# Altium schematic sheet 电源.SchDoc
size A4
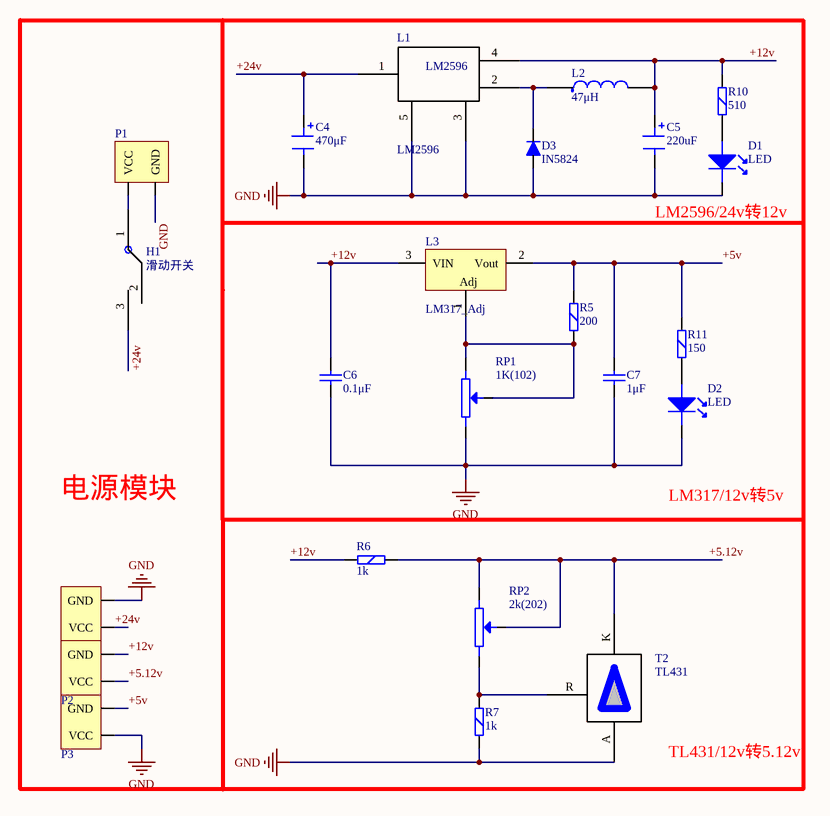
[diagram p0: 电源.SchDoc]

## Parts
C4  470μF  [电解电容_大]
C5  220uF  [电解电容_大]
C6  0.1μF  [电容_瓷片]
C7  1μF  [电容_瓷片]
D1  LED  [LED_G]
D2  LED  [LED_G]
D3  IN5824  [二极管_整流]
H1  滑动开关  [滑动开关]
L1  LM2596  [LM2596]
L2  47μH  [AL0410_V]
L3  LM317_Adj  [7805散热器]
P1  电源端子2P  [端子 - duplicate]  (value not drawn)
P2  电源端子2P  [端子 - duplicate]  (value not drawn)
P3  电源端子2P  [端子 - duplicate]  (value not drawn)
P4  电源端子2P  [端子 - duplicate]  (value not drawn)
R5  200  [1/4WA1]
R6  1k  [1/4WA1]
R7  1k  [1/4WA1]
R10  510  [1/4WA1]
R11  150  [1/4WA1]
RP1  1K(102)  [3296-103]
RP2  2k(202)  [3296-200]
T2  TL431  [TL431]

## Nets
GND: C4.2 C5.2 C6.1 C7.1 D1.2(K) D2.2(K) D3.1(A) L1.3 L1.5 P1.2(GND) P3.1(VCC) P4.2(GND) R7.2 RP1.2 T2.A
+5.12v: P2.1(VCC) R6.2 RP2.1 RP2.3 T2.K
+5v: C7.2 L3.2(Vout) P3.2(GND) R5.1 R11.1
+12v: C5.1 C6.2 L1.4 L2.2 L3.3(VIN) P2.2(GND) R6.1 R10.1
+24v: C4.1 H1.3 L1.1 P4.1(VCC)
NetD1_1: D1.1(A) R10.2
NetD2_1: D2.1(A) R11.2
NetD3_2: D3.2(K) L1.2 L2.1
NetH1_1: H1.1 P1.1(VCC)
NetL3_1: L3.1(Adj) R5.2 RP1.1 RP1.3
NetR7_1: R7.1 RP2.2 T2.R

Not connected (* = marked no-connect by the designer): H1 2

## Notes on the sheet
- (near D1) LM2596/24v转12v
- 电源模块
- LM317/12v转5v
- TL431/12v转5.12v

## Library data of the parts
C4 C5 = 电解电容_大: 电解电容
C6 C7 = 电容_瓷片: 瓷片电容
D1 D2 = LED: 发光二极管; Component Link1Description: 元件数据连接1，一般是生产厂商的元件描述连接。; Component Link 1URL: 元件厂商的网站连接1，通常是主页地址，如http://www.st.com/; ComponentLink2  Description: 元件数据连接2，一般是生产厂商的元件数据库连接。; Component Link 2URL: 元件厂商的网站连接2，通常是元件数据说明文件地址，如http://www.fairchildsemi.com/ds/2N%2F2N3904.pdf; Kind: General; Latest Revision Note: 最近的应用笔记修订本; Object: Diode; Created: 制造厂商; Datasheet Version: Apr-2016; Latest Revision Date: 13-Apr-2016; Package Description: DIODE0.4及DIODE0.7; Published: 13-Apr-2016; Publisher: Altium Limited; Spice Prefix: D; SubKind: Diode; Type: Diode
D3 = 二极管_整流: 整流二极管
L2 = Inductor4: Component Link1Description: 元件数据连接1，一般是生产厂商的元件描述连接。; Component Link 1URL: 元件厂商的网站连接1，通常是主页地址，如http://www.st.com/; ComponentLink2  Description: 元件数据连接2，一般是生产厂商的元件数据库连接。; Component Link 2URL: 元件厂商的网站连接2，通常是元件数据说明文件地址，如http://www.fairchildsemi.com/ds/2N%2F2N3904.pdf; Kind: General; Latest Revision Note: 最近的应用笔记修订本; Published: 13-Apr-2016; LatestRevisionDate: 13-Apr-2016; LatestRevisionNote: Re-released for DXP Platform.; PackageReference: 425; Publisher: Altium Limited; Created: 制造厂商; Datasheet Version: Apr-2016; Latest Revision Date: 13-Apr-2016; Object: Inductor; Package Description: 封装描述; Spice Prefix: L; SubKind: Inductor
L3 = LM317: 可调直流稳压芯片
P1-P4 = 电源端子2P: 电源端子
R5-R7 R10 R11 = Res_3: 1/4W电阻器; Object: Resistor; Kind: General; Latest Revision Note: 最近的应用笔记修订本; Component Link1Description: 元件数据连接1，一般是生产厂商的元件描述连接。; ComponentLink2  Description: 元件数据连接2，一般是生产厂商的元件数据库连接。; Component Link 1URL: 元件厂商的网站连接1，通常是主页地址，如http://www.st.com/; Component Link 2URL: 元件厂商的网站连接2，通常是元件数据说明文件地址，如http://www.fairchildsemi.com/ds/2N%2F2N3904.pdf; Value: 10K; LatestRevisionDate: 13-Apr-2016; Published: 13-Apr-2016; Publisher: Altium Limited; Created: 制造厂商; Datasheet Version: Apr-2016; Package Reference: AXIAL; Spice Prefix: R; Latest Revision Date: 13-Apr-2016; Package Description: AXIAL0.3-AXIA1.0; PackageVersion: Apr-2016; SubKind: Resistor; Type: Resistor
RP1 RP2 = RESVR: 滑动触点电位器; Object: Resistor; Kind: General; Latest Revision Note: 最近的应用笔记修订本; Component Link1Description: 元件数据连接1，一般是生产厂商的元件描述连接。; ComponentLink2  Description: 元件数据连接2，一般是生产厂商的元件数据库连接。; Component Link 1URL: 元件厂商的网站连接1，通常是主页地址，如http://www.st.com/; Component Link 2URL: 元件厂商的网站连接2，通常是元件数据说明文件地址，如http://www.fairchildsemi.com/ds/2N%2F2N3904.pdf; Value: 10K; LatestRevisionDate: 13-Apr-2016; Published: 13-Apr-2016; Publisher: Altium Limited; Created: 制造厂商; Datasheet Version: Apr-2016; Package Reference: AXIAL; Spice Prefix: R; Latest Revision Date: 13-Apr-2016; Package Description: AXIAL0.3-AXIA1.0; PackageVersion: Apr-2016; SubKind: Resistor; Type: Resistor